# EAGLE design PowerBricksBoard1 (EAGLE 9.6.2)
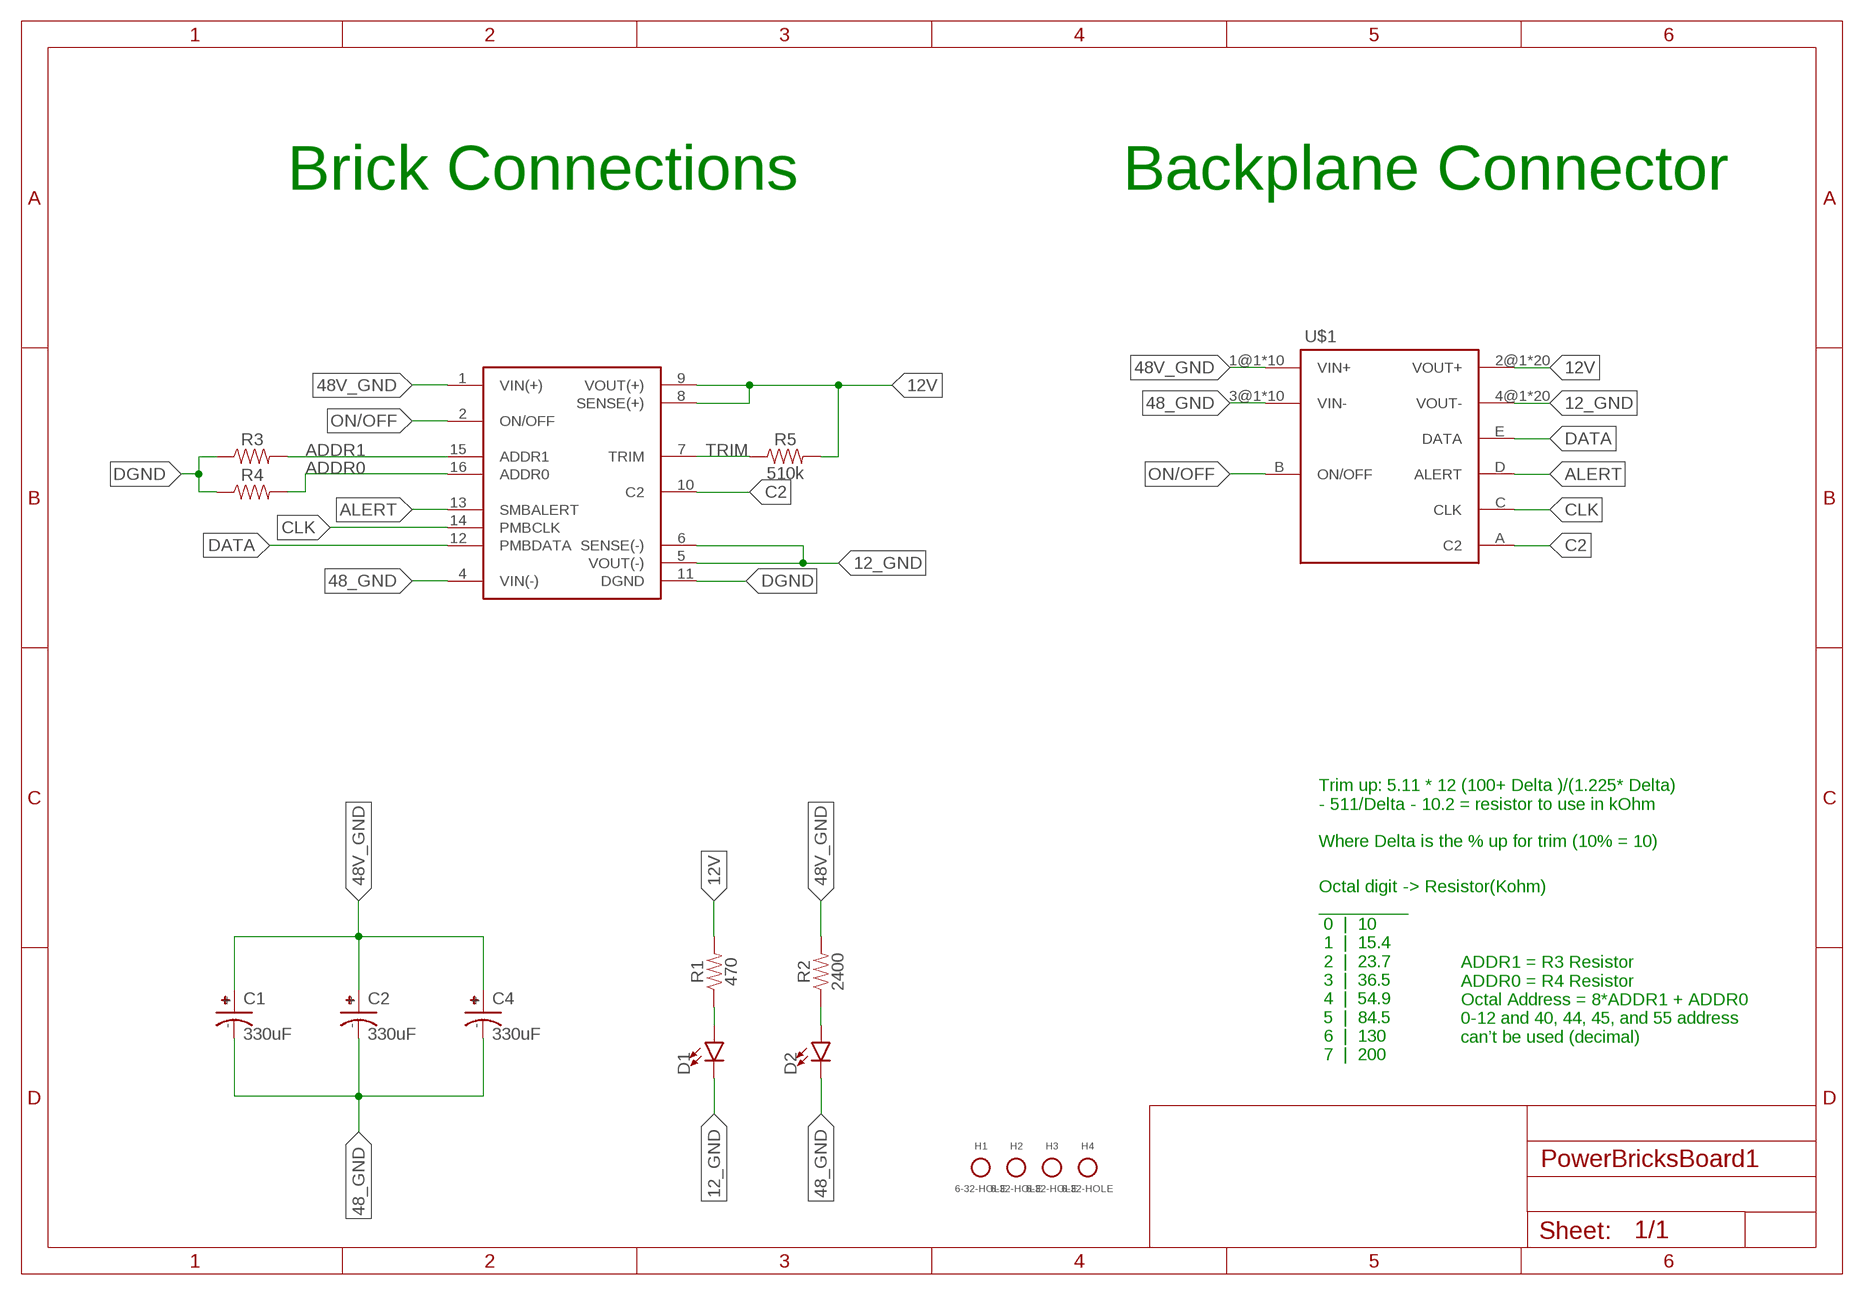
[diagram p0: schematic, sheet 1]

## Parts
C1  330uF  UCM1H331MNL1GS  [CAPAE1030X1050N]
C2  330uF  UCM1H331MNL1GS  [CAPAE1030X1050N]
C4  330uF  UCM1H331MNL1GS  [CAPAE1030X1050N]
D1  LED0603  [LED-0603]
D2  LED0603  [LED-0603]
H1  6-32-HOLE  [6-32-HOLE]
H2  6-32-HOLE  [6-32-HOLE]
H3  6-32-HOLE  [6-32-HOLE]
H4  6-32-HOLE  [6-32-HOLE]
R1  470  RESISTOR0603  [0603]
R2  2400  RESISTOR0603  [0603]
R3  RESISTOR0603  [0603]
R4  RESISTOR0603  [0603]
R5  510k  RESISTOR0603  [0603]
U$1  BRICK2DIST  [BRICK2DIST_D2]
U$2  Q48SC12050NRDH  [Q48SC12050NRDH]

## Nets
12_GND: D1.C U$1.4@1(VOUT-) U$1.4@2(VOUT-) U$1.4@3(VOUT-) U$1.4@4(VOUT-) U$1.4@5(VOUT-) U$1.4@6(VOUT-) U$1.4@7(VOUT-) U$1.4@8(VOUT-) U$1.4@9(VOUT-) U$1.4@10(VOUT-) U$1.4@11(VOUT-) U$1.4@12(VOUT-) U$1.4@13(VOUT-) U$1.4@14(VOUT-) U$1.4@15(VOUT-) U$1.4@16(VOUT-) U$1.4@17(VOUT-) U$1.4@18(VOUT-) U$1.4@19(VOUT-) U$1.4@20(VOUT-) U$2.5(VOUT(-)) U$2.6(SENSE(-))
12V: R1.2 R5.2 U$1.2@1(VOUT+) U$1.2@2(VOUT+) U$1.2@3(VOUT+) U$1.2@4(VOUT+) U$1.2@5(VOUT+) U$1.2@6(VOUT+) U$1.2@7(VOUT+) U$1.2@8(VOUT+) U$1.2@9(VOUT+) U$1.2@10(VOUT+) U$1.2@11(VOUT+) U$1.2@12(VOUT+) U$1.2@13(VOUT+) U$1.2@14(VOUT+) U$1.2@15(VOUT+) U$1.2@16(VOUT+) U$1.2@17(VOUT+) U$1.2@18(VOUT+) U$1.2@19(VOUT+) U$1.2@20(VOUT+) U$2.8(SENSE(+)) U$2.9(VOUT(+))
48_GND: C1.- C2.- C4.- D2.C U$1.3@1(VIN-) U$1.3@2(VIN-) U$1.3@3(VIN-) U$1.3@4(VIN-) U$1.3@5(VIN-) U$1.3@6(VIN-) U$1.3@7(VIN-) U$1.3@8(VIN-) U$1.3@9(VIN-) U$1.3@10(VIN-) U$2.4(VIN(-))
48V_GND: C1.+ C2.+ C4.+ R2.2 U$1.1@1(VIN+) U$1.1@2(VIN+) U$1.1@3(VIN+) U$1.1@4(VIN+) U$1.1@5(VIN+) U$1.1@6(VIN+) U$1.1@7(VIN+) U$1.1@8(VIN+) U$1.1@9(VIN+) U$1.1@10(VIN+) U$2.1(VIN(+))
ADDR0: R4.2 U$2.16(ADDR0)
ADDR1: R3.2 U$2.15(ADDR1)
ALERT: U$1.D(ALERT) U$2.13(SMBALERT)
C2: U$1.A(C2) U$2.10(C2)
CLK: U$1.C(CLK) U$2.14(PMBCLK)
DATA: U$1.E(DATA) U$2.12(PMBDATA)
DGND: R3.1 R4.1 U$2.11(DGND)
N$1: D1.A R1.1
N$2: D2.A R2.1
ON/OFF: U$1.B(ON/OFF) U$2.2(ON/OFF)
TRIM: R5.1 U$2.7(TRIM)

## Notes on the sheet
- Brick Connections | Backplane Connector
- Trim up: 5.11 * 12 (100+ Delta )/(1.225* Delta) 
  - 511/Delta - 10.2 = resistor to use in kOhm
  
  Where Delta is the % up for trim (10% = 10)
- ADDR1 = R3 Resistor
  ADDR0 = R4 Resistor
  Octal Address = 8*ADDR1 + ADDR0 
  0-12 and 40, 44, 45, and 55 address 
  can’t be used (decimal)
- Octal digit -> Resistor(Kohm) 
  _________
   0  |  10 
   1  |  15.4 
   2  |  23.7 
   3  |  36.5 
   4  |  54.9 
   5  |  84.5 
   6  |  130 
   7  |  200

## Library data of the parts
C1 C2 C4 = brick-capacitor-UCM1H331MNL1GS:UCM1H331MNL1GS: Nichicon 330uF 50 V Aluminium Electrolytic Capacitor SMD, CM Series 2000h 10 (Dia.) x 10mm Source: Datasheet <http://www.nichicon.co.jp/english/products/pdfs/e-ucm.pdf>; ARROW_PART_NUMBER: UCM1H331MNL1GS; ARROW_PRICE-STOCK: https://www.arrow.com/en/products/ucm1h331mnl1gs/nichicon; DESCRIPTION: Nichicon 330uF 50 V Aluminium Electrolytic Capacitor SMD, CM Series 2000h 10 (Dia.) x 10mm; HEIGHT: 10.5mm; MANUFACTURER_NAME: Nichicon; MANUFACTURER_PART_NUMBER: UCM1H331MNL1GS; MOUSER_PART_NUMBER: 647-UCM1H331MNL1GS; MOUSER_PRICE-STOCK: https://www.mouser.co.uk/ProductDetail/Nichicon/UCM1H331MNL1GS?qs=DSgADHjnLTkTovFLdbC%252BNg%3D%3D
D1 D2 = SparkFun-LED:LED: LED (Generic) Standard schematic elements and footprints for 5mm, 3mm, 1206, and 0603 sized LEDs. Generic LEDs with no color specified.
H1-H4 = Mounting Holes:6-32-HOLE
R1-R5 = SparkFun-Resistors:RESISTOR: Generic Resistor Package
U$1 = Brick_Dist_Connector:BRICK2DIST
U$2 = Delta Power Bricks - Q48SC12050NRDH:Q48SC12050NRDH

## Board
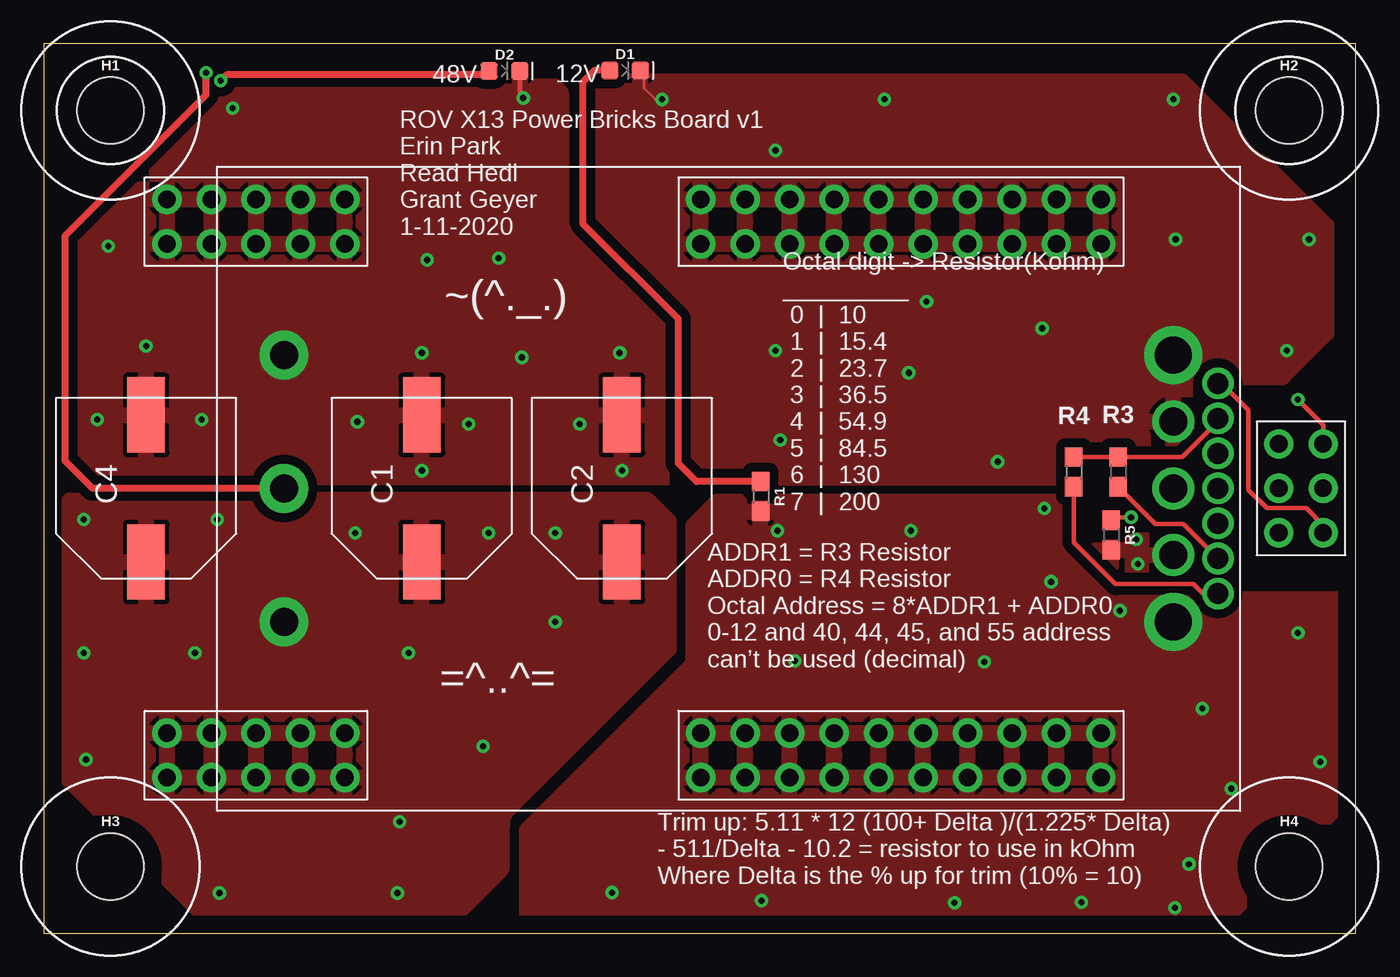
[diagram p1: board, top side]
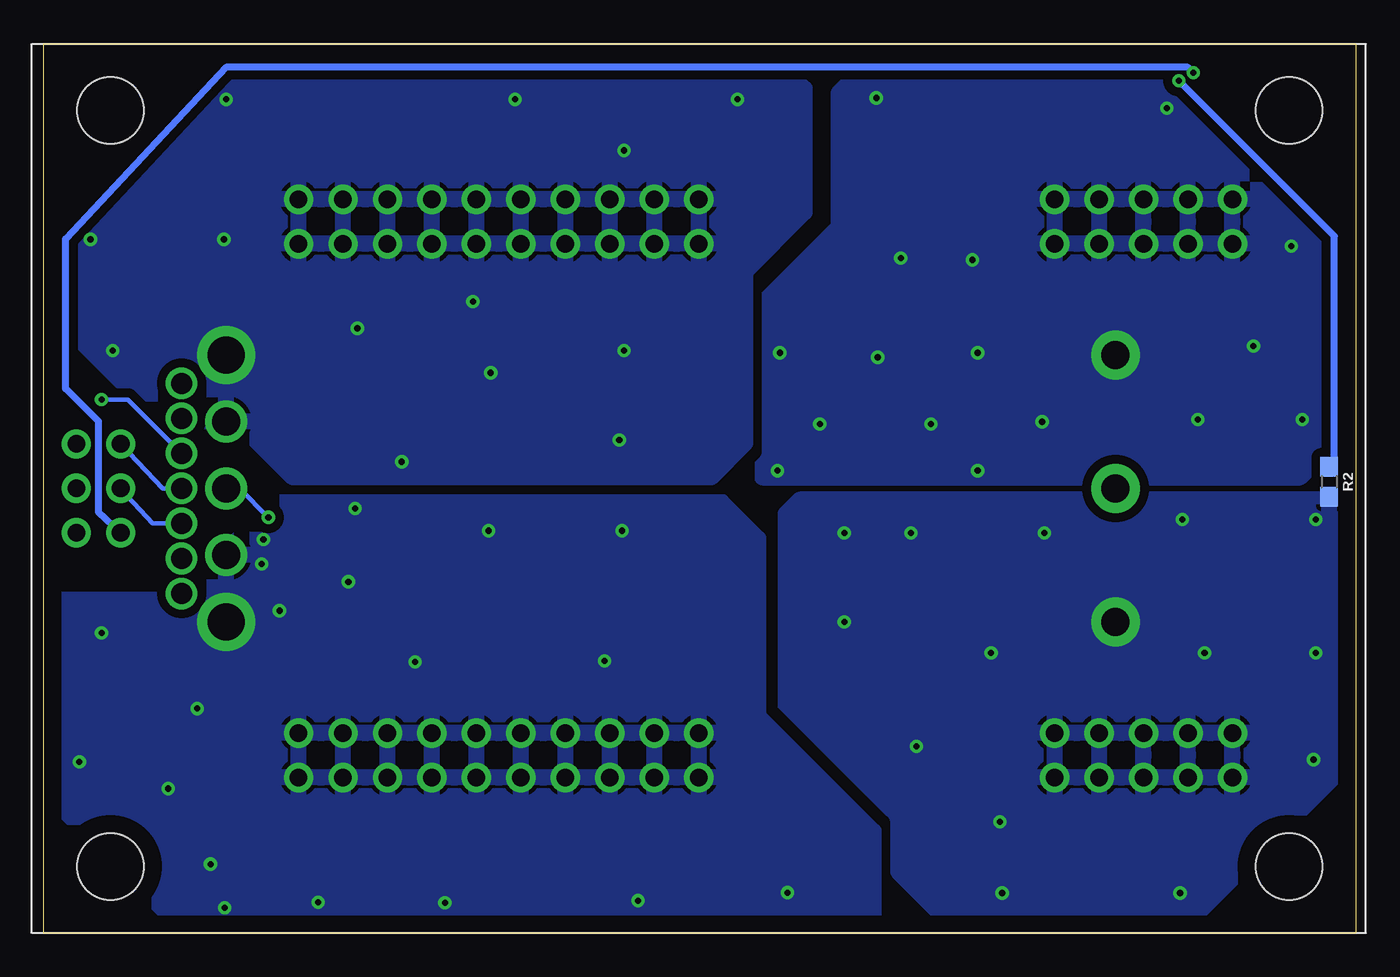
[diagram p2: board, bottom side, seen from below]

Size 74.93 x 50.8 mm. Coordinates in mm from the lower left corner, seen from the top.
Outline: 0,0 74.93,0 74.93,50.8 0,50.8 0,0
Copper layers (1*16): Top 0.035mm / dielectric 1.5mm / Bottom 0.035mm
Design rules "default": minimum track width 6mil, minimum drill 0.35mm, track to track 6mil, track to pad 6mil, pad to pad 6mil, via to via 6mil, smd to smd 6mil, copper to edge 40mil, drill to drill 6mil, minimum pad ring 10mil, minimum via ring 8mil, stop-mask expansion 4mil, vias tented up to drill 0mil, thermal gap 10mil

### Footprints (pad centres in the part's own frame; a part is rotated, then mirrored left to right if it is on the bottom)
CAPAE1030X1050N = smd 4.3 x 2.15: + -4.2,0; - 4.2,0
LED-0603 = smd 1 x 1: A -0.877,0; C 0.877,0
6-32-HOLE = hole 3.81: 0,0
0603 = smd 1.1 x 1: 1 -0.85,0; 2 0.85,0
BRICK2DIST_D2 = drill 1 pad 1.676: 1@1 -30.48,-16.51; 1@2 -30.48,-13.97; 1@3 -27.94,-16.51; 1@4 -27.94,-13.97; 1@5 -25.4,-16.51; 1@6 -25.4,-13.97; 1@7 -22.86,-16.51; 1@8 -22.86,-13.97; 1@9 -20.32,-16.51; 1@10 -20.32,-13.97; 2@1 0,-16.51; 2@2 0,-13.97; 2@3 2.54,-16.51; 2@4 2.54,-13.97; 2@5 5.08,-16.51; 2@6 5.08,-13.97; 2@7 7.62,-16.51; 2@8 7.62,-13.97; 2@9 10.16,-16.51; 2@10 10.16,-13.97; 2@11 12.7,-16.51; 2@12 12.7,-13.97; 2@13 15.24,-16.51; 2@14 15.24,-13.97; 2@15 17.78,-16.51; 2@16 17.78,-13.97; 2@17 20.32,-13.97; 2@18 22.86,-13.97; 2@19 22.86,-16.51; 2@20 20.32,-16.51; 3@1 -30.48,13.97; 3@2 -30.48,16.51; 3@3 -27.94,13.97; 3@4 -27.94,16.51; 3@5 -25.4,13.97; 3@6 -25.4,16.51; 3@7 -22.86,13.97; 3@8 -22.86,16.51; 3@9 -20.32,13.97; 3@10 -20.32,16.51; 4@1 0,13.97; 4@2 0,16.51; 4@3 2.54,13.97; 4@4 2.54,16.51; 4@5 5.08,13.97; 4@6 5.08,16.51; 4@7 7.62,13.97; 4@8 7.62,16.51; 4@9 10.16,13.97; 4@10 10.16,16.51; 4@11 12.7,13.97; 4@12 12.7,16.51; 4@13 15.24,13.97; 4@14 15.24,16.51; 4@15 17.78,13.97; 4@16 17.78,16.51; 4@17 20.32,16.51; 4@18 22.86,16.51; 4@19 22.86,13.97; 4@20 20.32,13.97; A 35.56,-2.54; B 33.02,-2.54; C 33.02,0; D 33.02,2.54; E 35.56,2.54; F 35.56,0
Q48SC12050NRDH = drill 1.6 pad 2.794: 1 0,0; 2 0,7.62; 4 0,15.24 | drill 2.1 pad 3.302: 5 50.8,15.24; 9 50.8,0 | drill 1.6: 6 50.8,11.43; 7 50.8,7.62; 8 50.8,3.81 | drill 1.2: 10 53.34,13.62; 11 53.34,11.62; 12 53.34,9.62; 13 53.34,7.62; 14 53.34,5.62; 15 53.34,3.62; 16 53.34,1.62

### Placement (x,y rotation side)
C1  21.59,25.4 90 top
C2  33.02,25.4 90 top
C4  5.84,25.4 90 top
D1  33.2,49.28 0 top
D2  26.31,49.25 0 top
H1  3.81,46.99 0 top
H2  71.12,46.99 0 top
H3  3.81,3.81 0 top
H4  71.12,3.81 0 top
R1  40.94,24.94 270 top
R2  1.52,25.78 270 bottom
R3  61.37,26.34 270 top
R4  58.83,26.34 270 top
R5  60.96,22.73 270 top
U$1  37.52,25.4 0 top
U$2  13.72,17.78 0 top

### Tracks (layer width: path | path; a pad name or v marks a point on that pad's centre or on a via)
12_GND  (via drill 0.35)
  Top 0.152: D1.C 34.29,49.06 34.29,48.26 34.92,47.62 v35.31,47.62
  other vias: 48.01,47.62 64.52,47.62 72.26,39.62 70.99,33.27 54.48,26.92 42.06,28.17 41.78,33.27 41.78,44.7 50.42,36.07 64.64,39.62 57.02,34.54 49.4,32
  pour Top (isolate 0.508): 31.52,48.64 31.52,41 36.65,35.86 36.65,27.41 38.02,26.04 62.87,26.04 68.58,31.75 70.74,31.75 73.28,34.29 73.28,40.39 65.02,48.64
  pour Bottom (isolate 0.508): 31.47,48.23 31.47,41.17 34.87,37.77 34.87,27.97 36.8,26.04 60.71,26.04 63.25,28.57 67.56,28.57 73.53,34.54 73.53,44.45 65.41,52.58 35.81,52.58
12V  (via drill 0.35)
  other vias: 62.48,21.08 62.38,22.48 57.15,24.26 61.47,18.41 41.91,22.99 49.53,22.99 57.53,20.07 41,1.85 42.9,15.54 32.46,2.31 64.59,1.45 65.41,3.94 72.9,9.78 71.63,17.14 67.82,8.26 66.17,12.83 59.26,1.75 53.72,15.49 52.02,1.73
  pour Bottom (isolate 0.508): 34.14,12.42 27.53,5.82 27.53,-2.54 64.26,-2.54 78.49,11.68 78.49,15.37 74.8,19.05 67.31,19.05 61.72,24.64 36.22,24.64 34.14,22.56
  pour Top (isolate 0.508): 37.08,15.37 27.58,5.87 27.58,-3.81 62.87,-3.81 78.49,11.81 78.49,15.37 74.8,19.05 67.31,19.05 61.72,24.64 38.46,24.64 37.08,23.27
48_GND  (via drill 0.35)
  Top 0.254: v27.38,47.7 27.19,47.89 D2.C
  other vias: 24.26,29.08 30.61,29.08 25.98,38.56 33.02,26.42 21.59,26.42 27.3,32.89 21.89,38.46 32.89,33.15 21.59,33.15 17.91,29.21 9.02,29.34 3.05,29.34 5.84,33.53 10.79,47.12 3.68,39.24
  pour Bottom (isolate 0.508, rank 2): 2.54,52.07 25.45,52.07 29.54,47.98 29.54,40.34 33.88,35.99 33.88,26.04 3.17,26.04 2.54,26.67 1.27,26.67 -1.27,29.21 -1.27,48.26
  pour Top (isolate 0.508, rank 2): 10.79,48.39 29.16,48.39 29.54,48.01 29.54,40.34 35.56,34.32 35.56,26.04 3.17,26.04 2.03,27.18 2.03,39.62
  pour Top (no thermals): 12.75,35.56 14.78,35.56 16.1,34.24 16.1,31.93 14.86,30.68 12.65,30.68 11.43,31.9 11.43,34.24
  pour Bottom (no thermals): 12.75,35.56 14.58,35.56 16.1,34.04 16.1,31.93 14.86,30.68 12.65,30.68 11.43,31.9 11.43,34.24
48V_GND  (via drill 0.35)
  other vias: 17.78,22.86 25.4,22.86 29.21,22.86 25.1,10.67 20.32,6.35 29.21,17.78 20.83,16 20.19,2.29 10.03,2.29 2.41,9.91 2.29,23.62 9.91,23.62 2.29,16 8.64,16
  pour Top (isolate 0.508, rank 2): 1.55,24.77 34.44,24.77 35.76,23.44 35.76,15.82 26.14,6.2 26.14,3.66 21.21,-1.27 11.43,-1.27 -1.27,11.43 -1.27,21.95
  pour Bottom (isolate 0.508, rank 2): 1.52,24.77 31.75,24.77 32.56,23.95 32.56,12.62 26.14,6.2 26.14,3.51 21.36,-1.27 11.43,-1.27 0,10.16 0,23.24
  pour Top (no thermals): 12.75,20.32 14.58,20.32 16.1,18.8 16.1,16.69 14.86,15.44 12.65,15.44 11.43,16.66 11.43,19
  pour Bottom (no thermals): 12.75,20.32 14.58,20.32 16.1,18.8 16.1,16.69 14.86,15.44 12.65,15.44 11.43,16.66 11.43,19
ADDR0
  Top 0.254: U$2.16 66.2,19.4 65.66,19.94 61.21,19.94 58.83,22.33 R4.2
ADDR1
  Top 0.254: U$2.15 65.09,23.37 63.49,23.37 R3.2
ALERT
  Bottom 0.254: U$1.D 68.15,25.4 U$2.13
C2
  Top 0.254: U$2.10 67.28,31.4 68.81,29.87 68.81,25.32 69.85,24.28 72.11,24.28 73.08,23.28 U$1.A
CLK
  Bottom 0.254: U$1.C 70.54,25.37 68.71,23.4 U$2.14
DATA  (via drill 0.35)
  Top 0.254: U$1.E 73.08,29.03 v71.63,30.48
  Bottom 0.254: U$2.12 70.14,30.48 v71.63,30.48
DGND
  Top 0.254: R4.1 R3.1 65.02,27.19 67.06,29.22 U$2.11
N$1
  Top 0.406: R1.1 37.29,25.79 36.25,26.83 36.25,35.08 30.79,40.54 30.79,48.6 31.46,49.28 D1.A
N$2  (via drill 0.35)
  Top 0.254: D2.A 25.21,49.02
  Top 0.406: 25.21,49.02 10.44,49.02 v10.11,48.69
  Bottom 0.254: R2.1 1.22,26.94
  Bottom 0.406: 1.22,26.94 1.22,39.8 v10.11,48.69
ON/OFF  (via drill 0.35)
  Top 0.406: U$2.2 2.79,25.4 1.22,26.98 1.22,39.83 9.27,47.88 v9.27,49.15
  Bottom 0.406: v9.27,49.15 9.58,49.45 64.51,49.45 73.69,39.65 73.69,31.1 71.81,29.22 71.81,24.04 U$1.B
TRIM  (via drill 0.35)
  Top 0.254: v62.1,23.75 60.96,23.75 R5.1
  Bottom 0.254: v62.1,23.75 63.75,25.4 U$2.7

### Text on the board
tNames: 48V | 12V | ROV X13 Power Bricks Board v1 / Erin Park / Read Hedl / Grant Geyer / 1-11-2020 | ~(^._.) | Octal digit -> Resistor(Kohm) / _________ / 0 | 10 / 1 | 15.4 / 2 | 23.7 / 3 | 36.5 / 4 | 54.9 / 5 | 84.5 / 6 | 130 / 7 | 200 | ADDR1 = R3 Resistor / ADDR0 = R4 Resistor / Octal Address = 8*ADDR1 + ADDR0 / 0-12 and 40, 44, 45, and 55 address / can’t be used (decimal) | =^..^= | Trim up: 5.11 * 12 (100+ Delta )/(1.225* Delta) / - 511/Delta - 10.2 = resistor to use in kOhm / Where Delta is the % up for trim (10% = 10)